# Altium project BQ25895_BMS.PrjPcb
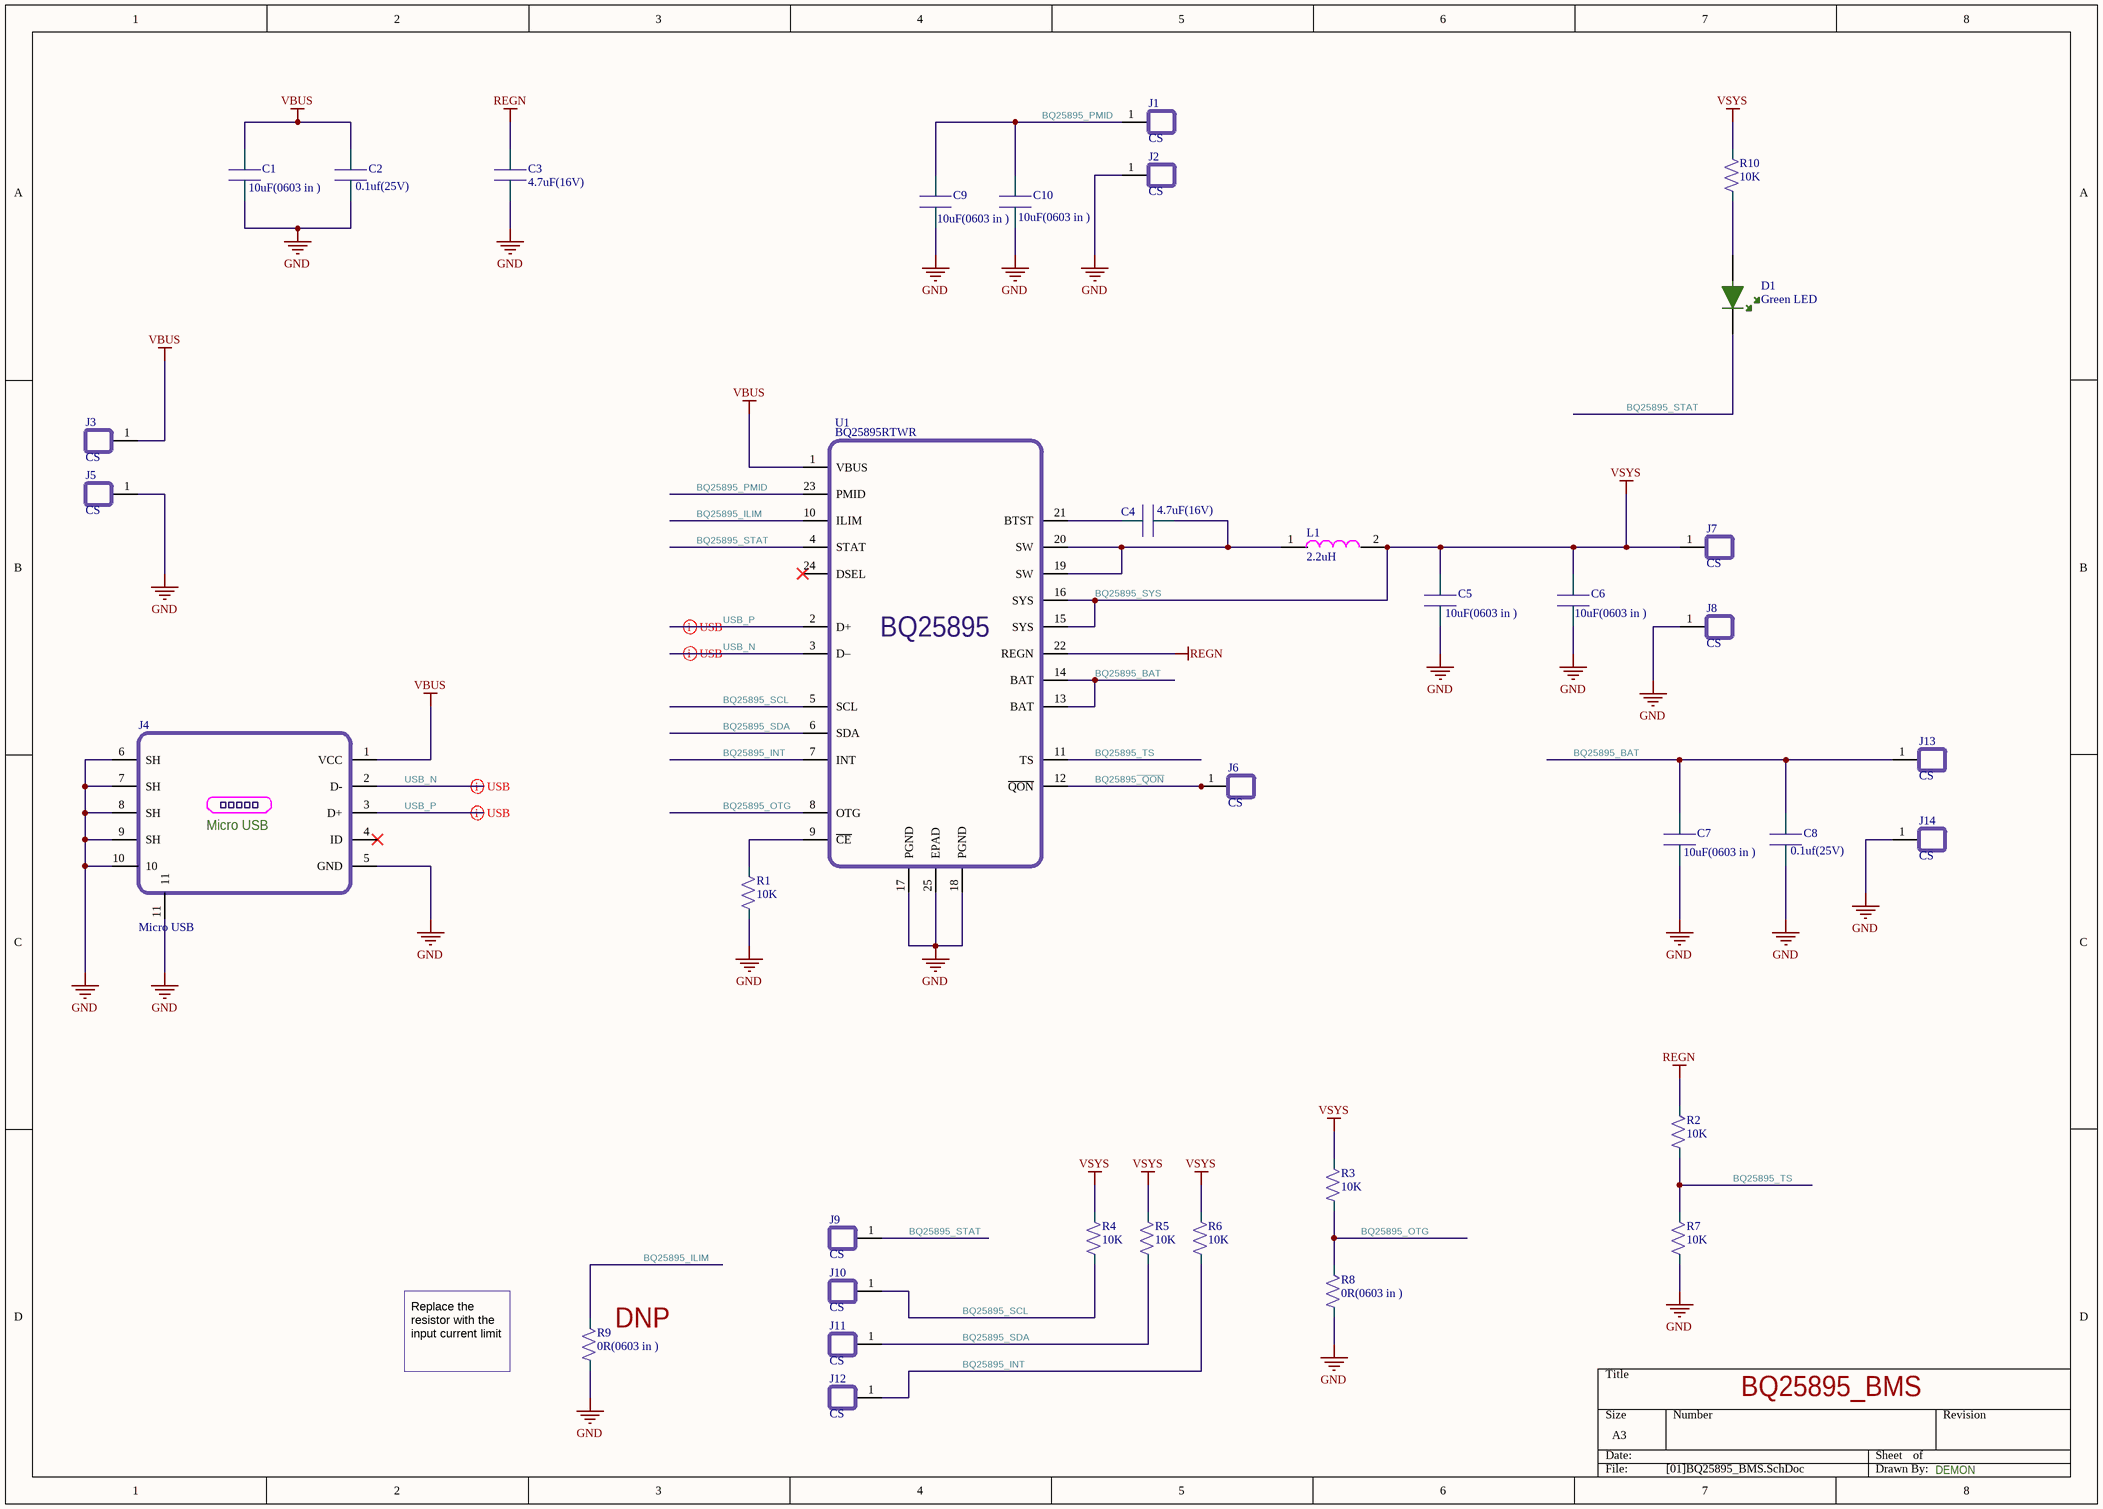
[diagram p0: [01]BQ25895_BMS.SchDoc]
1 sheet, 37 parts. Net scope: global (net labels, ports and power ports of the same name join across sheets).
Board file: BQ25895BMS.PcbDoc

## Sheet [01]BQ25895_BMS.SchDoc: BQ25895_BMS
size A3; Organization: Altium Limited; Address1: L3, 12a Rodborough Rd; Address2: Frenchs Forest; Address3: NSW; Address4: Australia 2086

### Parts
C1  10uF(0603 in )  [Capacitor_0603]
C2  0.1uf(25V)  [Capacitor_0603]
C3  4.7uF(16V)  [Capacitor_0603]
C4  4.7uF(16V)  [CAPACITOR_0402]
C5  10uF(0603 in )  [Capacitor_0603]
C6  10uF(0603 in )  [Capacitor_0603]
C7  10uF(0603 in )  [Capacitor_0603]
C8  0.1uf(25V)  [Capacitor_0603]
C9  10uF(0603 in )  [Capacitor_0603]
C10  10uF(0603 in )  [Capacitor_0603]
D1  Green LED  [0603_LED]
J1  CS  [castellated_small]
J2  CS  [castellated_small]
J3  CS  [castellated_small]
J4  Micro USB  [TE_1981568-1]
J5  CS  [castellated_small]
J6  CS  [castellated_small]
J7  CS  [castellated_small]
J8  CS  [castellated_small]
J9  CS  [castellated_small]
J10  CS  [castellated_small]
J11  CS  [castellated_small]
J12  CS  [castellated_small]
J13  CS  [castellated_small]
J14  CS  [castellated_small]
L1  2.2uH  [22uh inductor]
R1  10K  [RESISTOR0603]
R2  10K  [RESISTOR0603]
R3  10K  [RESISTOR0603]
R4  10K  [RESISTOR0603]
R5  10K  [RESISTOR0603]
R6  10K  [RESISTOR0603]
R7  10K  [RESISTOR0603]
R8  0R(0603 in )  [RESISTOR0603]
R9  0R(0603 in )  [RESISTOR0603]
R10  10K  [RESISTOR0603]
U1  BQ25895RTWR  [24-WQFN]

### Nets
BQ25895_SYS: C5.2 C6.2 J7.1 L1.2 R3.2 R4.2 R5.2 R6.2 R10.2 U1.15(SYS) U1.16(SYS)  [also labelled VSYS]
GND: C1.1 C2.1 C3.1 C5.1 C6.1 C7.1 C8.1 C9.1 C10.1 J2.1 J4.5(GND) J4.6(SH) J4.7(SH) J4.8(SH) J4.9(SH) J4.10 J4.11 J5.1 J8.1 J14.1 R1.1 R7.1 R8.1 R9.1 U1.17(PGND) U1.18(PGND) U1.25(EPAD)
REGN: C3.2 R2.2 U1.22(REGN)
VBUS: C1.2 C2.2 J3.1 J4.1(VCC) U1.1(VBUS)
BQ25895~{_QON}: J6.1 U1.12(~{QON})
BQ25895_BAT: C7.2 C8.2 J13.1 U1.13(BAT) U1.14(BAT)
BQ25895_ILIM: R9.2 U1.10(ILIM)
BQ25895_INT: J12.1 R6.1 U1.7(INT)
BQ25895_OTG: R3.1 R8.2 U1.8(OTG)
BQ25895_PMID: C9.2 C10.2 J1.1 U1.23(PMID)
BQ25895_SCL: J10.1 R4.1 U1.5(SCL)
BQ25895_SDA: J11.1 R5.1 U1.6(SDA)
BQ25895_STAT: D1.2 J9.1 U1.4(STAT)
BQ25895_TS: R2.1 R7.2 U1.11(TS)
USB_N: J4.2(D-) U1.3(D–)
USB_P: J4.3(D+) U1.2(D+)
NetC4_1: C4.1 L1.1 U1.19(SW) U1.20(SW)
NetC4_2: C4.2 U1.21(BTST)
NetD1_1: D1.1 R10.1
NetR1_2: R1.2 U1.9(~{CE})

Not connected (* = marked no-connect by the designer): J4 4(ID)*; U1 24(DSEL)*

### Layout directives
differential pair: USB_N, USB_P

### Notes on the sheet
- (near R9) DNP
- Replace the resistor with the input current limit
- DEMON
- Title
- Size:
- Date:
- File:
- A2
- Number:
- Time:
- Revision:
- Sheet
- of
- (in symbol BQ25895RTWR) BQ25895

### Library data of the parts
C1 C5-C7 C9 C10 = GRM188R61E106KA73D: 10µF ±10% 25V Ceramic Capacitor X5R 0603 (1608 Metric); Manufacturer: Murata Electronics; MinTemp: -55°C; MaxTemp: 85°C; ManufacturerPartNumber: GRM188R61E106KA73D; SupplierPartNumber: 490-18214-1-ND; PartStatus: Active; Price: 0.32; ComponentLink1Description: SupplierURL; ComponentLink1URL: https://www.digikey.com/en/products/detail/murata-electronics/GRM188R61E106KA73D/9867922; Supplier: Digikey
C2 C8 = C0603C104J3RAC7411: ±5% 25V Ceramic Capacitor X7R 0603 (1608 Metric); Manufacturer: KEMET; MinTemp: -55°C; MaxTemp: 125°C; ManufacturerPartNumber: C0603C104J3RAC7411; SupplierPartNumber: 399-C0603C104J3RAC7411CT-ND; Supplier: Digikey; PartStatus: Active; Price: 0.43; ComponentLink1Description: SupplierURL; ComponentLink1URL: https://www.digikey.com/en/products/detail/kemet/C0603C104J3RAC7411/12701256
C3 = GRM188C71C475KE21D: 4.7µF ±10% 16V Ceramic Capacitor X7S 0603 (1608 Metric); Manufacturer: Murata Electronics; MinTemp: -55°C; MaxTemp: 125°C; ManufacturerPartNumber: GRM188C71C475KE21D; Supplier: Digikey; SupplierPartNumber: 490-16337-1-ND; PartStatus: Active; Price: 0.38
C4 = 0402YD475MAT2A: 4.7µF ±20% 16V Ceramic Capacitor X5R 0402 (1005 Metric); Manufacturer: AVX Corporation; MinTemp: -55°C; MaxTemp: 85°C; ManufacturerPartNumber: 0402YD475MAT2A; SupplierPartNumber: 478-10788-1-ND; PartStatus: Active; Price: 0.29; ComponentLink1Description: SupplierURL; ComponentLink1URL: https://www.digikey.com/en/products/detail/avx-corporation/0402YD475MAT2A/6221357; Supplier: Digikey
D1 = APHD1608LZGCK: Green 570nm LED Indication - Discrete 1.7V 0603 (1608 Metric); MinTemp: -40; MaxTemp: +85; ManufacturerPartNumber: APHD1608LZGCK; SupplierPartNumber: 754-2036-1-ND; PartStatus: Active; Price: 0.68; ComponentLink1Description: SupplierURL; ComponentLink1URL: https://www.digikey.com/en/products/detail/kingbright/APHD1608LZGCK/7043068
J1-J3 J5-J14 = castellated_Small
J4 = 1981568-1: USB - micro B USB 2.0 Receptacle Connector 5 Position Surface Mount, Right Angle; Manufacturer: TE Connectivity AMP Connectors; MinTemp: -30°C; MaxTemp: 85°C; ManufacturerPartNumber: 1981568-1; SupplierPartNumber: A97800CT-ND; Supplier: Digikey; PartStatus: Active; Price: 1.71; ComponentLink1Description: SupplierURL; ComponentLink1URL: https://www.digikey.com/en/products/detail/te-connectivity-amp-connectors/1981568-1/1786248
L1 = 7440650022: FIXED IND 2.2UH 6.2A 15 MOHM SMD; Manufacturer: Würth Elektronik; MinTemp: -40; MaxTemp: 125°C; ManufacturerPartNumber: 7440650022; SupplierPartNumber: 732-1055-1-ND; Supplier: Digikey; Price: 1.80; ComponentLink1Description: SupplierURL; ComponentLink1URL: https://www.digikey.com/en/products/detail/würth-elektronik/7440650022/1638460
R1-R7 R10 = RMCF0603JT10K0: 10 kOhms ±5% 0.1W, 1/10W Chip Resistor 0603 (1608 Metric) Automotive AEC-Q200 Thick Film; Manufacturer: Stackpole Electronics Inc; MinTemp: -55°C; MaxTemp: 155°C; ManufacturerPartNumber: RMCF0603JT10K0; SupplierPartNumber: RMCF0603JT10K0CT-ND; Supplier: Digikey; PartStatus: Active; Price: 0.10; ComponentLink1Description: SupplierURL; ComponentLink1URL: https://www.digikey.com/en/products/detail/stackpole-electronics-inc/RMCF0603JT10K0/1758104
R8 R9 = RMCF0603ZT0R00: 0 Ohms Jumper 0.1W, 1/10W Chip Resistor 0603 (1608 Metric) Automotive AEC-Q200 Thick Film; Min Temp: -55°C; Max Temp: 155°C; Manufacturer Part Number: RMCF0603ZT0R00; Supplier Part Number: RMCF0603ZT0R00CT-ND; Part Status: Active; Price: 0.10; ComponentLink1Description: Supplier Link; ComponentLink1URL: https://www.digikey.com/en/products/detail/stackpole-electronics-inc/RMCF0603ZT0R00/1756908
U1 = BQ25895RTWR: Charger IC Lithium Ion/Polymer 24-WQFN (4x4); Manufacturer: Texas Instruments; MinTemp: -40°C; MaxTemp: 85°C; ManufacturerPartNumber: BQ25895RTWR; SupplierPartNumber: 296-44345-1-ND; Supplier: Digikey; PartStatus: Active; Price: 3.46; ComponentLink1Description: SupplierURL; ComponentLink1URL: https://www.digikey.com/en/products/detail/texas-instruments/BQ25895RTWR/5214018